# Altium schematic sheet vdriver.SchDoc
size A4
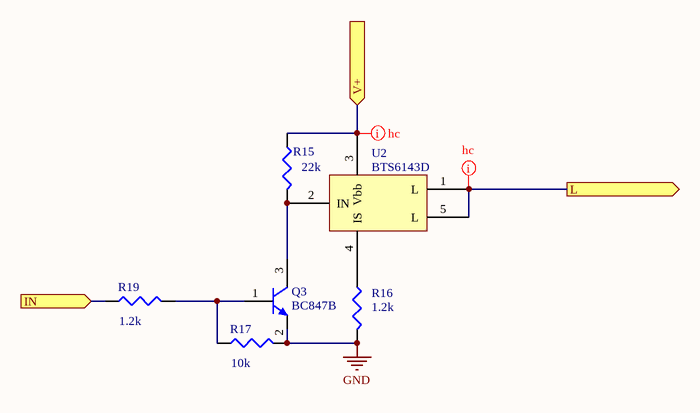
[diagram p0: vdriver.SchDoc]

## Parts
Q3  BC847B  [SOT-23_N]
R15  22k  [J1-0603]
R16  1.2k  [J1-0603]
R17  10k  [J1-0603]
R19  1.2k  [J1-0603]
U2  BTS6143D  [BTS6143D]

## Ports
IN (in), L (out), V+ (in)

## Nets
GND: Q3.2(E) R16.2 R17.2
IN: R19.1 ; port IN
L: U2.1(L) U2.5(L) ; port L
V+: R15.1 U2.3(Vbb) ; port V+
NetQ3_1: Q3.1(B) R17.1 R19.2
NetQ3_3: Q3.3(C) R15.2 U2.2(IN)
NetR16_1: R16.1 U2.4(IS)

## Layout directives
net class hc: L, V+

## Library data of the parts
Q3 = NPN: NPN Bipolar Transistor; Published: 8-Jun-2000; LatestRevisionDate: 17-Jul-2002; LatestRevisionNote: Re-released for DXP Platform.; PackageReference: TO-226-AA; Publisher: Altium Limited; PackageDescription: TO, Flat Index; 3 In-Line, Axial Leads; Body Dia. 4.8mm; Leads 0.55 x 0.51 mm (max); Code_JEDEC: TO-226-AA
R15-R17 = Res3: Resistor; Published: 8-Jun-2000; LatestRevisionDate: 29-May-2009; LatestRevisionNote: IPC-7351 Footprint Added.; PackageReference: J1-0603; Publisher: Altium Limited; PackageDescription: Chip Resistor
  R15: Value: 22K
  R16: Value: 1.2K
  R17: Value: 10K
R19 = Res3: Resistor; Value: 10K; Published: 8-Jun-2000; LatestRevisionDate: 29-May-2009; LatestRevisionNote: IPC-7351 Footprint Added.; PackageReference: J1-0603; Publisher: Altium Limited; PackageDescription: Chip Resistor